# Altium schematic sheet Main.SchDoc
size D; SheetNumber: 1; SheetTotal: 1; SPICEModelCacheCWOFPNVQ: <root> / <DocumentId>CWOFPNVQ</DocumentId> / </root>
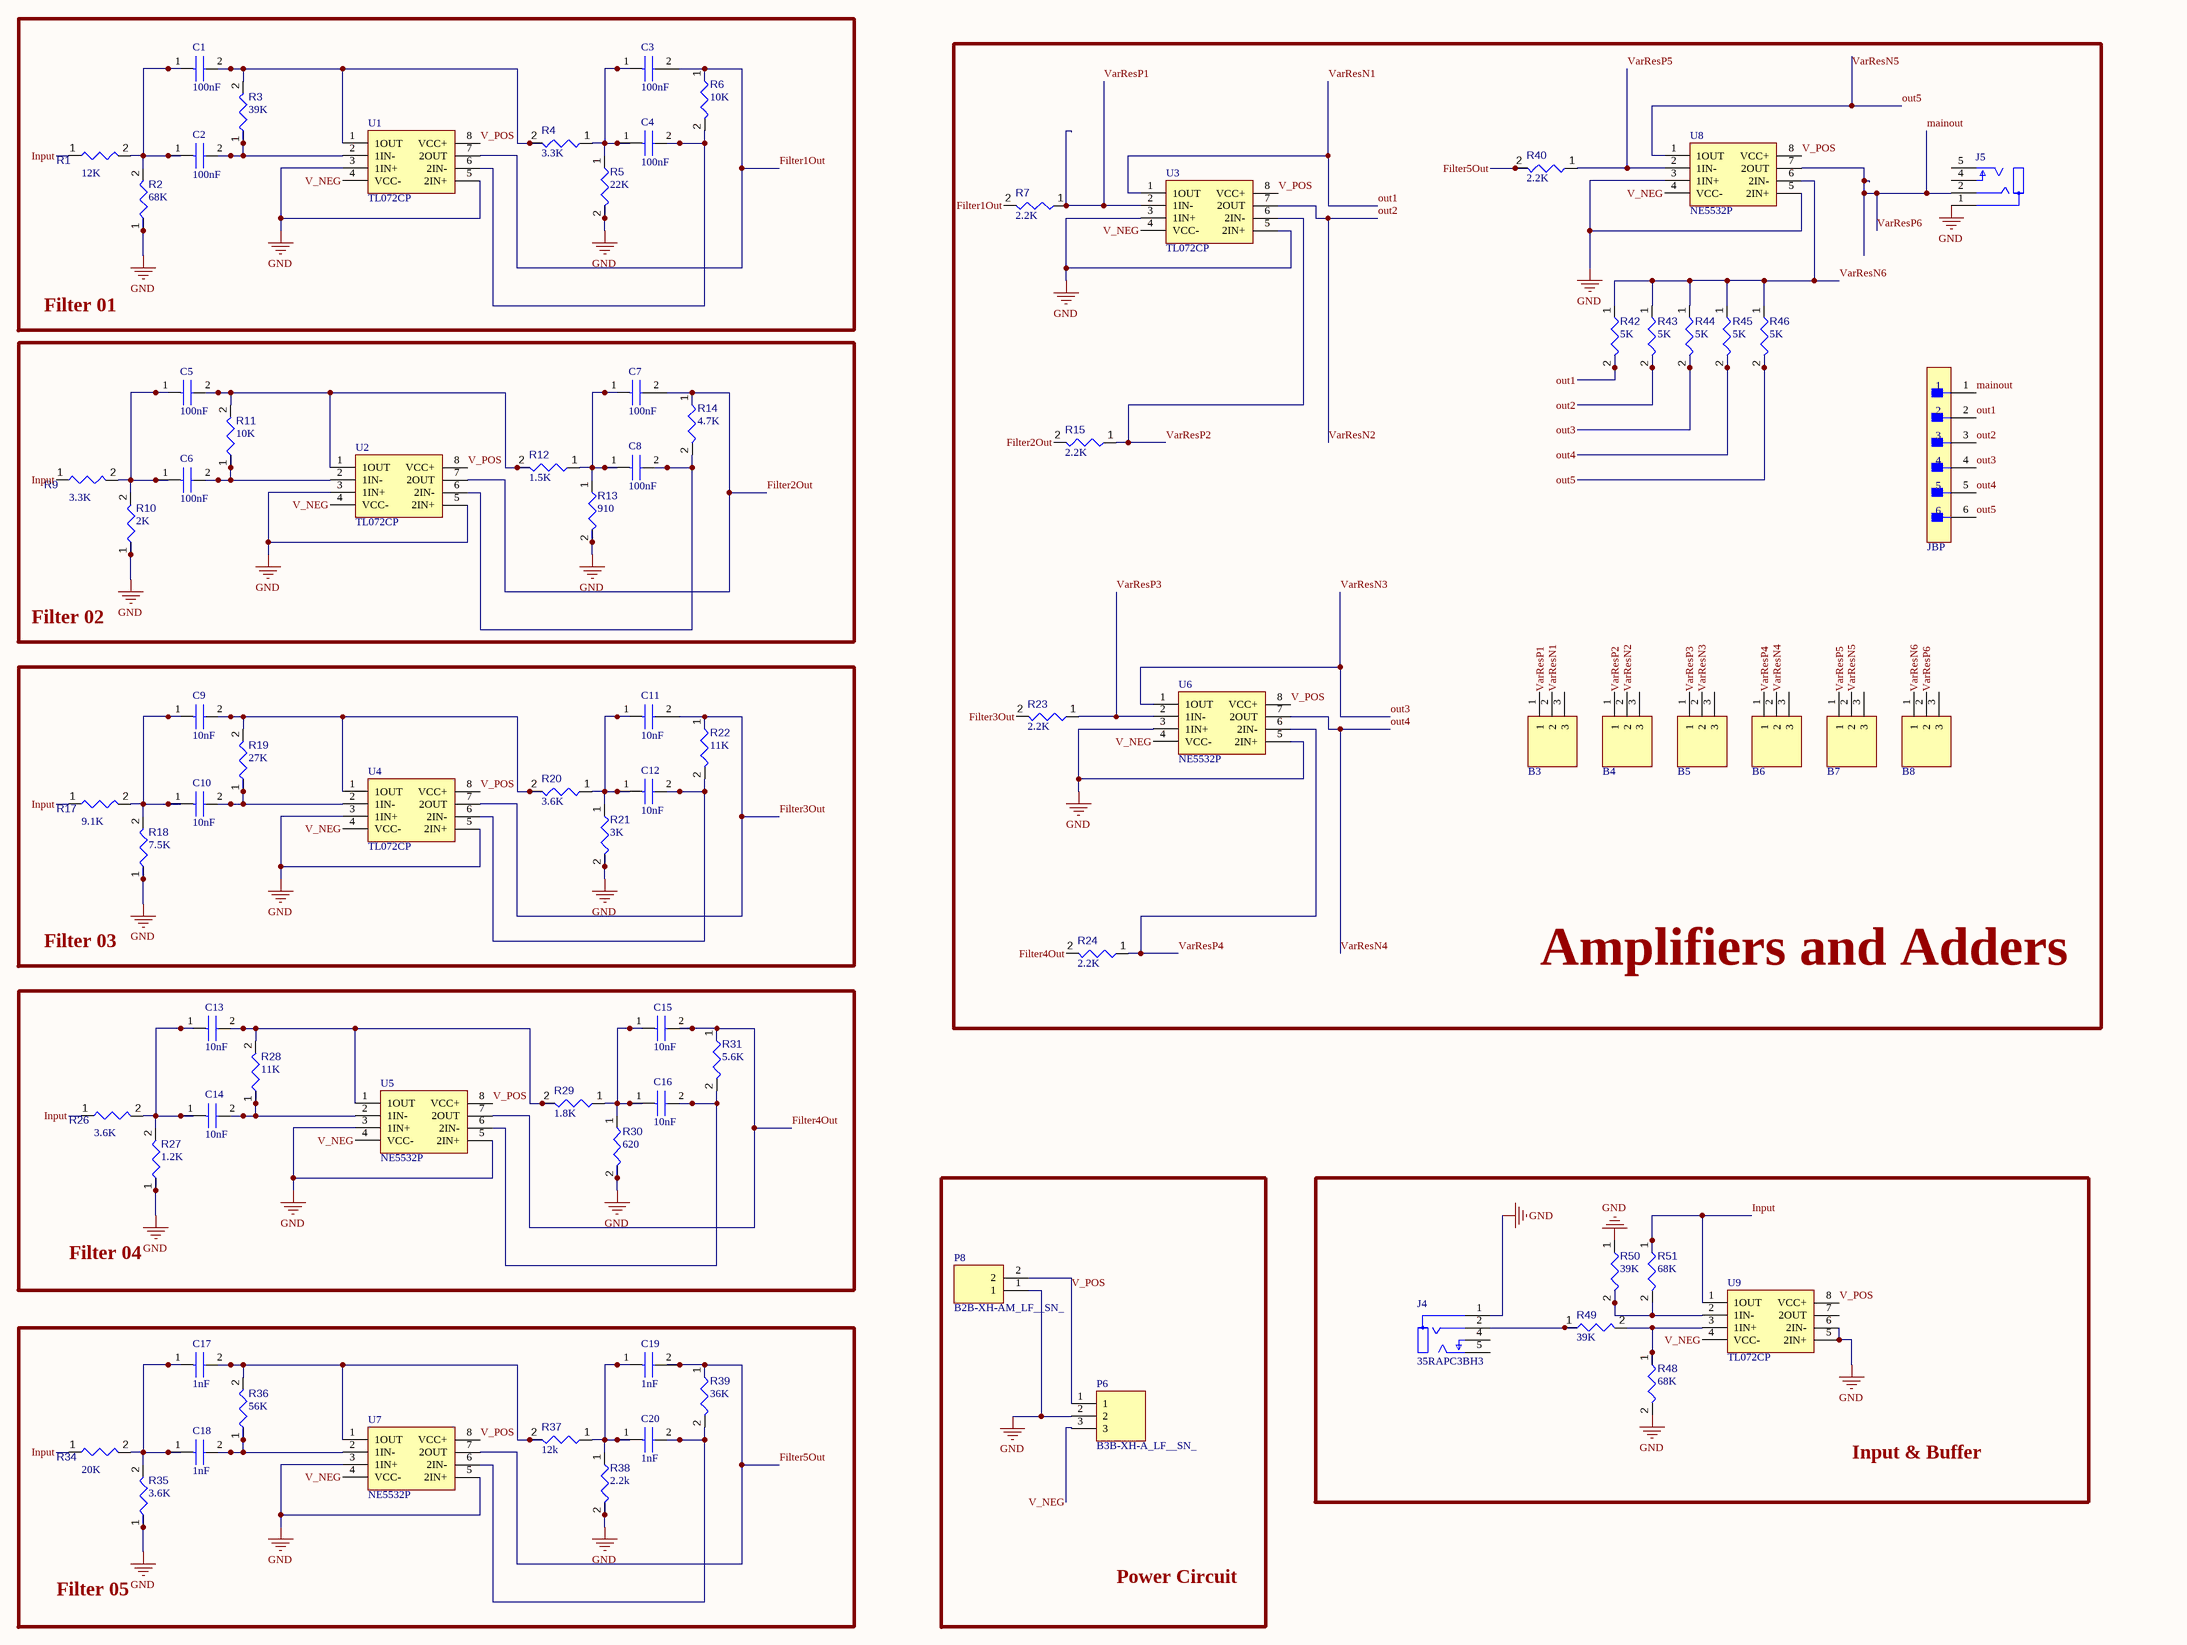
[diagram p0: Main.SchDoc]

## Parts
B3  14910A0BHSX10502KA  [14910F0GJSX10103KA]  (value not drawn)
B4  14910A0BHSX10502KA  [14910F0GJSX10103KA]  (value not drawn)
B5  14910A0BHSX10502KA  [14910F0GJSX10103KA]  (value not drawn)
B6  14910A0BHSX10502KA  [14910F0GJSX10103KA]  (value not drawn)
B7  14910A0BHSX10502KA  [14910F0GJSX10103KA]  (value not drawn)
B8  14910A0BHSX10502KA  [14910F0GJSX10103KA]  (value not drawn)
C1  100nF  [K104K15X7RF5TL2]
C2  100nF  [K104K15X7RF5TL2]
C3  100nF  [K104K15X7RF5TL2]
C4  100nF  [K104K15X7RF5TL2]
C5  100nF  [K104K15X7RF5TL2]
C6  100nF  [K104K15X7RF5TL2]
C7  100nF  [K104K15X7RF5TL2]
C8  100nF  [K104K15X7RF5TL2]
C9  10nF  [K104K15X7RF5TL2]
C10  10nF  [K104K15X7RF5TL2]
C11  10nF  [K104K15X7RF5TL2]
C12  10nF  [K104K15X7RF5TL2]
C13  10nF  [K104K15X7RF5TL2]
C14  10nF  [K104K15X7RF5TL2]
C15  10nF  [K104K15X7RF5TL2]
C16  10nF  [K104K15X7RF5TL2]
C17  1nF  [K104K15X7RF5TL2]
C18  1nF  [K104K15X7RF5TL2]
C19  1nF  [K104K15X7RF5TL2]
C20  1nF  [K104K15X7RF5TL2]
J4  35RAPC3BH3  [FP-35RAPC3BH3-MFG]
J5  35RAPC3BH3  [FP-35RAPC3BH3-MFG]  (value not drawn)
JBP  B6B-XH-A(LF)(SN)  [FP-B6B-XH-A_LF_SN-MFG]  (value not drawn)
P6  B3B-XH-A_LF__SN_  [B3BXHALFSN]
P8  B2B-XH-AM_LF__SN_  [B2BXHAMLFSN]
R1  value 12K  [RESA60-630X240]  (hidden comment: MFR-25FBF52-221R)
R2  value 68K  [RESA60-630X240]  (hidden comment: MFR-25FBF52-221R)
R3  value 39K  [RESA60-630X240]  (hidden comment: MFR-25FBF52-221R)
R4  value 3.3K  [RESA60-630X240]  (hidden comment: MFR-25FBF52-221R)
R5  value 22K  [RESA60-630X240]  (hidden comment: MFR-25FBF52-221R)
R6  value 10K  [RESA60-630X240]  (hidden comment: MFR-25FBF52-221R)
R7  value 2.2K  [RESA60-630X240]  (hidden comment: MFR-25FBF52-221R)
R9  value 3.3K  [RESA60-630X240]  (hidden comment: MFR-25FBF52-221R)
R10  value 2K  [RESA60-630X240]  (hidden comment: MFR-25FBF52-221R)
R11  value 10K  [RESA60-630X240]  (hidden comment: MFR-25FBF52-221R)
R12  value 1.5K  [RESA60-630X240]  (hidden comment: MFR-25FBF52-221R)
R13  value 910  [RESA60-630X240]  (hidden comment: MFR-25FBF52-221R)
R14  value 4.7K  [RESA60-630X240]  (hidden comment: MFR-25FBF52-221R)
R15  value 2.2K  [RESA60-630X240]  (hidden comment: MFR-25FBF52-221R)
R17  value 9.1K  [RESA60-630X240]  (hidden comment: MFR-25FBF52-221R)
R18  value 7.5K  [RESA60-630X240]  (hidden comment: MFR-25FBF52-221R)
R19  value 27K  [RESA60-630X240]  (hidden comment: MFR-25FBF52-221R)
R20  value 3.6K  [RESA60-630X240]  (hidden comment: MFR-25FBF52-221R)
R21  value 3K  [RESA60-630X240]  (hidden comment: MFR-25FBF52-221R)
R22  value 11K  [RESA60-630X240]  (hidden comment: MFR-25FBF52-221R)
R23  value 2.2K  [RESA60-630X240]  (hidden comment: MFR-25FBF52-221R)
R24  value 2.2K  [RESA60-630X240]  (hidden comment: MFR-25FBF52-221R)
R26  value 3.6K  [RESA60-630X240]  (hidden comment: MFR-25FBF52-221R)
R27  value 1.2K  [RESA60-630X240]  (hidden comment: MFR-25FBF52-221R)
R28  value 11K  [RESA60-630X240]  (hidden comment: MFR-25FBF52-221R)
R29  value 1.8K  [RESA60-630X240]  (hidden comment: MFR-25FBF52-221R)
R30  value 620  [RESA60-630X240]  (hidden comment: MFR-25FBF52-221R)
R31  value 5.6K  [RESA60-630X240]  (hidden comment: MFR-25FBF52-221R)
R34  value 20K  [RESA60-630X240]  (hidden comment: MFR-25FBF52-221R)
R35  value 3.6K  [RESA60-630X240]  (hidden comment: MFR-25FBF52-221R)
R36  value 56K  [RESA60-630X240]  (hidden comment: MFR-25FBF52-221R)
R37  value 12k  [RESA60-630X240]  (hidden comment: MFR-25FBF52-221R)
R38  value 2.2k  [RESA60-630X240]  (hidden comment: MFR-25FBF52-221R)
R39  value 36K  [RESA60-630X240]  (hidden comment: MFR-25FBF52-221R)
R40  value 2.2K  [RESA60-630X240]  (hidden comment: MFR-25FBF52-221R)
R42  value 5K  [RESA60-630X240]  (hidden comment: MFR-25FBF52-221R)
R43  value 5K  [RESA60-630X240]  (hidden comment: MFR-25FBF52-221R)
R44  value 5K  [RESA60-630X240]  (hidden comment: MFR-25FBF52-221R)
R45  value 5K  [RESA60-630X240]  (hidden comment: MFR-25FBF52-221R)
R46  value 5K  [RESA60-630X240]  (hidden comment: MFR-25FBF52-221R)
R48  value 68K  [RESA60-630X240]  (hidden comment: MFR-25FBF52-221R)
R49  value 39K  [RESA60-630X240]  (hidden comment: MFR-25FBF52-221R)
R50  value 39K  [RESA60-630X240]  (hidden comment: MFR-25FBF52-221R)
R51  value 68K  [RESA60-630X240]  (hidden comment: MFR-25FBF52-221R)
U1  TL072CP  [DIP794W53P254L959H508Q8N]
U2  TL072CP  [DIP794W53P254L959H508Q8N]
U3  TL072CP  [DIP794W53P254L959H508Q8N]
U4  TL072CP  [DIP794W53P254L959H508Q8N]
U5  NE5532P  [DIP794W53P254L959H508Q8N]
U6  NE5532P  [DIP794W53P254L959H508Q8N]
U7  NE5532P  [DIP794W53P254L959H508Q8N]
U8  NE5532P  [DIP794W53P254L959H508Q8N]
U9  TL072CP  [DIP794W53P254L959H508Q8N]

## Blocks framed on the sheet
Filter 01: C1-C4 R1-R6 U1
Amplifiers and Adders: B3-B8 J5 JBP R7 R15 R23 R24 R40 R42-R46 U3 U6 U8
Filter 02: C5-C8 R9-R14 U2
Filter 03: C9-C12 R17-R22 U4
Filter 04: C13-C16 R26-R31 U5
Power Circuit: P6 P8
Input & Buffer: J4 R48-R51 U9
Filter 05: C17-C20 R34-R39 U7

## Nets
GND: J4.1 J5.1 P6.2 P8.1 R2.1 R5.2 R10.1 R13.2 R18.1 R21.2 R27.1 R30.2 R35.1 R38.2 R48.2 R50.1 U1.3(1IN+) U1.5(2IN+) U2.3(1IN+) U2.5(2IN+) U3.3(1IN+) U3.5(2IN+) U4.3(1IN+) U4.5(2IN+) U5.3(1IN+) U5.5(2IN+) U6.3(1IN+) U6.5(2IN+) U7.3(1IN+) U7.5(2IN+) U8.3(1IN+) U8.5(2IN+) U9.5(2IN+) U9.6(2IN-)
Filter1Out: C3.2(-) R6.1 R7.2 U1.7(2OUT)
Filter2Out: C7.2(-) R14.1 R15.2 U2.7(2OUT)
Filter3Out: C11.2(-) R22.1 R23.2 U4.7(2OUT)
Filter4Out: C15.2(-) R24.2 R31.1 U5.7(2OUT)
Filter5Out: C19.2(-) R39.1 R40.2 U7.7(2OUT)
Input: R1.1 R9.1 R17.1 R26.1 R34.1 R51.1 U9.1(1OUT)
mainout: B8.2 J5.2 JBP.1 U8.7(2OUT)  [also labelled VarResP6]
out1: B3.2 JBP.2 R42.2 U3.1(1OUT)  [also labelled VarResN1]
out2: B4.2 JBP.3 R43.2 U3.7(2OUT)  [also labelled VarResN2]
out3: B5.2 JBP.4 R44.2 U6.1(1OUT)  [also labelled VarResN3]
out4: B6.2 JBP.5 R45.2 U6.7(2OUT)  [also labelled VarResN4]
out5: B7.2 JBP.6 R46.2 U8.1(1OUT)  [also labelled VarResN5]
V_NEG: P6.3 U1.4(VCC-) U2.4(VCC-) U3.4(VCC-) U4.4(VCC-) U5.4(VCC-) U6.4(VCC-) U7.4(VCC-) U8.4(VCC-) U9.4(VCC-)
V_POS: P6.1 P8.2 U1.8(VCC+) U2.8(VCC+) U3.8(VCC+) U4.8(VCC+) U5.8(VCC+) U6.8(VCC+) U7.8(VCC+) U8.8(VCC+) U9.8(VCC+)
VarResN6: B8.1 R42.1 R43.1 R44.1 R45.1 R46.1 U8.6(2IN-)
VarResP1: B3.1 R7.1 U3.2(1IN-)
VarResP2: B4.1 R15.1 U3.6(2IN-)
VarResP3: B5.1 R23.1 U6.2(1IN-)
VarResP4: B6.1 R24.1 U6.6(2IN-)
VarResP5: B7.1 R40.1 U8.2(1IN-)
NetC1_1: C1.1(+) C2.1(+) R1.2 R2.2
NetC1_2: C1.2(-) R3.2 R4.2 U1.1(1OUT)
NetC2_2: C2.2(-) R3.1 U1.2(1IN-)
NetC3_1: C3.1(+) C4.1(+) R4.1 R5.1
NetC4_2: C4.2(-) R6.2 U1.6(2IN-)
NetC5_1: C5.1(+) C6.1(+) R9.2 R10.2
NetC5_2: C5.2(-) R11.2 R12.2 U2.1(1OUT)
NetC6_2: C6.2(-) R11.1 U2.2(1IN-)
NetC7_1: C7.1(+) C8.1(+) R12.1 R13.1
NetC8_2: C8.2(-) R14.2 U2.6(2IN-)
NetC9_1: C9.1(+) C10.1(+) R17.2 R18.2
NetC9_2: C9.2(-) R19.2 R20.2 U4.1(1OUT)
NetC10_2: C10.2(-) R19.1 U4.2(1IN-)
NetC11_1: C11.1(+) C12.1(+) R20.1 R21.1
NetC12_2: C12.2(-) R22.2 U4.6(2IN-)
NetC13_1: C13.1(+) C14.1(+) R26.2 R27.2
NetC13_2: C13.2(-) R28.2 R29.2 U5.1(1OUT)
NetC14_2: C14.2(-) R28.1 U5.2(1IN-)
NetC15_1: C15.1(+) C16.1(+) R29.1 R30.1
NetC16_2: C16.2(-) R31.2 U5.6(2IN-)
NetC17_1: C17.1(+) C18.1(+) R34.2 R35.2
NetC17_2: C17.2(-) R36.2 R37.2 U7.1(1OUT)
NetC18_2: C18.2(-) R36.1 U7.2(1IN-)
NetC19_1: C19.1(+) C20.1(+) R37.1 R38.1
NetC20_2: C20.2(-) R39.2 U7.6(2IN-)
NetJ4_2: J4.2 R49.1
NetR48_1: R48.1 R49.2 U9.3(1IN+)
NetR50_2: R50.2 R51.2 U9.2(1IN-)

Not connected (* = marked no-connect by the designer): B3 3; B4 3; B5 3; B6 3; B7 3; B8 3; J4 4 5; J5 4 5; U9 7(2OUT)

## Library data of the parts
B3-B8 = 14910A0BHSX10502KA: Variable Resistor; Manufacturer_Name: Vishay; Datasheet Link: https://www.mouser.com/datasheet/2/427/148149-239924.pdf; Manufacturer_Part_Number: 14910A0BHSX10502KA; Mouser Part Number: 594-14910A0BHSP502KA; Mouser Price/Stock: https://www.mouser.co.uk/ProductDetail/Vishay-Spectrol/14910A0BHSX10502KA?qs=sKxHajcpPaBuEjDBnLxOZg%3D%3D
C1-C20 = K104K15X7RF5TL2: Capacitor; Manufacturer_Name: Vishay; Datasheet Link: https://componentsearchengine.com/Datasheets/1/K104K15X7RF5TL2.pdf; Height: 5.58mm; Manufacturer_Part_Number: K104K15X7RF5TL2; Mouser Part Number: 594-K104K15X7RF5TL2; Mouser Price/Stock: https://www.mouser.co.uk/ProductDetail/Vishay-BC-Components/K104K15X7RF5TL2?qs=sYfpZ29HcUR83i3HiPAFlA%3D%3D; Arrow Part Number: K104K15X7RF5TL2; Arrow Price/Stock: https://www.arrow.com/en/products/k104k15x7rf5tl2/vishay?region=nac
J4 J5 = CMP-47983-000003-1: CONN JACK STEREO 3.5MM R/A; Gender: Female; Number of Positions: 3; Body Color: Black; Number of Ports: 1; Voltage Rating: 500V; Shielding: Unshielded; Body Material: Brass; Orientation: Right Angle; RoHS Compliant: Yes; Termination: Solder; Lead Free: Lead Free; Package Quantity: 1; Series: 35; Housing Material: PBT; Color: Black; Packaging: Bulk; Contact Plating: Silver; Mount: Through Hole; Contact Material: Copper Alloy; Number of Terminals/Pins: 3
JBP = CMP-17439-000076-1: CONN HEADER VERT 6POS 2.5MM
P6 = B3B-XH-A_LF__SN_: Connector; Manufacturer_Name: JST (JAPAN SOLDERLESS TERMINALS); Manufacturer_Part_Number: B3B-XH-A(LF)(SN); Datasheet Link: https://datasheet.lcsc.com/szlcsc/1812131720_JST-Sales-America-B3B-XH-A-LF-SN_C144394.pdf; Height: 7mm; Arrow Part Number: B3B-XH-A(LF)(SN); Arrow Price/Stock: https://www.arrow.com/en/products/b3b-xh-a-lf-sn/jst-manufacturing?region=europe
P8 = B2B-XH-AM_LF__SN_: Connector; Manufacturer_Name: JST (JAPAN SOLDERLESS TERMINALS); Manufacturer_Part_Number: B2B-XH-AM(LF)(SN); Datasheet Link: https://www.jst-mfg.com/product/pdf/eng/eXH.pdf; Height: 7mm; Arrow Part Number: B2B-XH-AM(LF)(SN); Arrow Price/Stock: https://www.arrow.com/en/products/b2b-xh-am-lf-sn/jst-manufacturing?region=europe
R1-R3 R9-R11 R17-R19 R26-R28 R34-R36 = CMP-009-00051-4: Axial Resistor, 221 Ohm, +/- 1%, 250 mW, -55 to 155 degC, 2-Pin THD, RoHS, Bulk; Manufacturer: Yageo; Power: 250mW; Voltage Rating: 250V; RoHS Compliant: True; Mounting Technology: TH; Tolerance: 1%; Max Operating Temperature: 155°C; Min Operating Temperature: -55°C; Case/Package: Axial; Package Quantity: 200; Manufacturer URL: http://www.yageo.com/; Package Reference: MFR-25; Datasheet URL: http://www.yageo.com/documents/recent/Yageo%20LR_MFR_2013.pdf; Packaging: Bulk; Package Description: 2-Pin Axial Lead, Dia 2.4 mm, Body Length 6.3 mm; Datasheet Version: Apr-13
R4-R7 R12-R15 R20-R24 R29-R31 R37-R40 R42-R46 R48-R51 = CMP-009-00051-4: Manufacturer: Yageo; Tolerance: 1%; Power: 250mW; Voltage Rating: 250V; RoHS Compliant: True; Mounting Technology: TH; Max Operating Temperature: 155°C; Min Operating Temperature: -55°C; Case/Package: Axial; Package Quantity: 200; Manufacturer URL: http://www.yageo.com/; Package Reference: MFR-25; Datasheet URL: http://www.yageo.com/documents/recent/Yageo%20LR_MFR_2013.pdf; Packaging: Bulk; Package Description: 2-Pin Axial Lead, Dia 2.4 mm, Body Length 6.3 mm; Datasheet Version: Apr-13
U1-U4 U9 = TL072CP: Integrated Circuit; Manufacturer_Name: Texas Instruments; Datasheet Link: http://www.ti.com/lit/ds/symlink/tl071a.pdf; Height: 5.08mm; Manufacturer_Part_Number: TL072CP; Mouser Part Number: 595-TL072CP; Mouser Price/Stock: https://www.mouser.co.uk/ProductDetail/Texas-Instruments/TL072CP?qs=5nGYs9Do7G3e6Tx9uHIgUA%3D%3D; Arrow Part Number: TL072CP; Arrow Price/Stock: https://www.arrow.com/en/products/tl072cp/texas-instruments?region=nac
U5-U8 = NE5532P: Integrated Circuit; Manufacturer_Name: Texas Instruments; Datasheet Link: http://www.ti.com/lit/ds/symlink/ne5532a.pdf; Height: 5.08mm; Manufacturer_Part_Number: NE5532P; Mouser Part Number: 595-NE5532P; Mouser Price/Stock: https://www.mouser.co.uk/ProductDetail/Texas-Instruments/NE5532P?qs=3pnr37ZAbK%252Bre0OAHDmGsw%3D%3D; Arrow Part Number: NE5532P; Arrow Price/Stock: https://www.arrow.com/en/products/ne5532p/texas-instruments?region=nac